# EAGLE schematic vcf-lm324-mono (EAGLE 7.6.0)
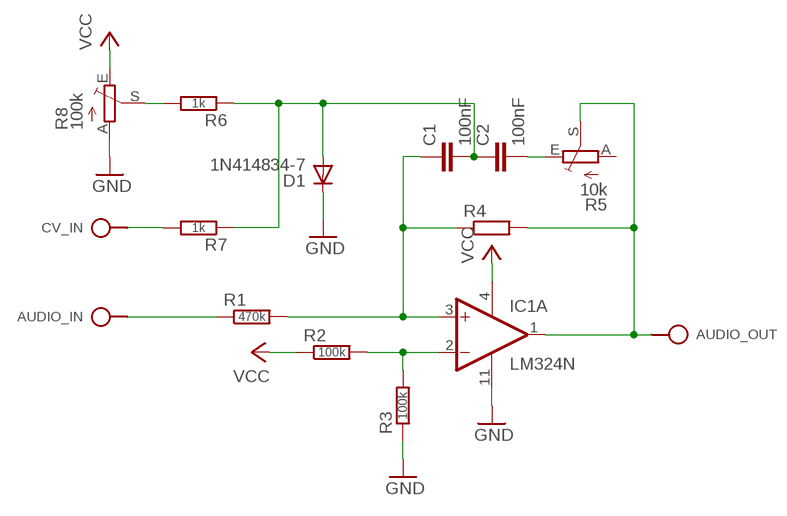
[diagram p0: schematic, sheet 1]

## Parts
AUDIO_IN  SPAD  [SPAD]
AUDIO_OUT  SPAD  [SPAD]
C1  100nF  C050-024X044  [C050-024X044]
C2  100nF  C050-024X044  [C050-024X044]
CV_IN  SPAD  [SPAD]
D1  1N414834-7  [DO34-7]
IC1  LM324N  [DIL14]
R1  470k  R0202/7  [0202/7]
R2  100k  R0202/7  [0202/7]
R3  100k  R0202/7  [0202/7]
R4  R0202/7  [0202/7]
R5  10k  TRIM_EU-RJ9W  [RJ9W]
R6  1k  R0202/7  [0202/7]
R7  1k  R0202/7  [0202/7]
R8  100k  TRIM_EU-RJ9W  [RJ9W]

## Nets
GND: D1.C IC1.11(P:V-) R3.1 R8.A
N$1: AUDIO_IN.1 R1.1
N$2: C1.1 IC1.3(A:+IN) R1.2 R4.1
N$3: C2.2 R5.E
N$4: AUDIO_OUT.1 IC1.1(A:OUT) R4.2 R5.S
N$5: R6.2 R8.S
N$7: IC1.2(A:-IN) R2.2 R3.2
N$8: CV_IN.1 R7.2
N$9: C1.2 C2.1 D1.A R6.1 R7.1
VCC: IC1.4(P:V+) R2.1 R8.E
Unconnected: IC1.5(B:+IN) IC1.6(B:-IN) IC1.7(B:OUT) IC1.8(C:OUT) IC1.9(C:-IN) IC1.10(C:+IN) IC1.12(D:+IN) IC1.13(D:-IN) IC1.14(D:OUT) R5.A

## Library data of the parts
AUDIO_IN AUDIO_OUT CV_IN = pad:SPAD
C1 C2 = c:C: CAPACITOR, European symbol
D1 = d:1N4148
IC1 = ic:LM324: OP AMP
R1-R4 R6 R7 = r:R: RESISTOR, European symbol
R5 R8 = pot:TRIM_EU-: POTENTIOMETER